# EAGLE design TdsReworkfullSMD (EAGLE 9.2.0)
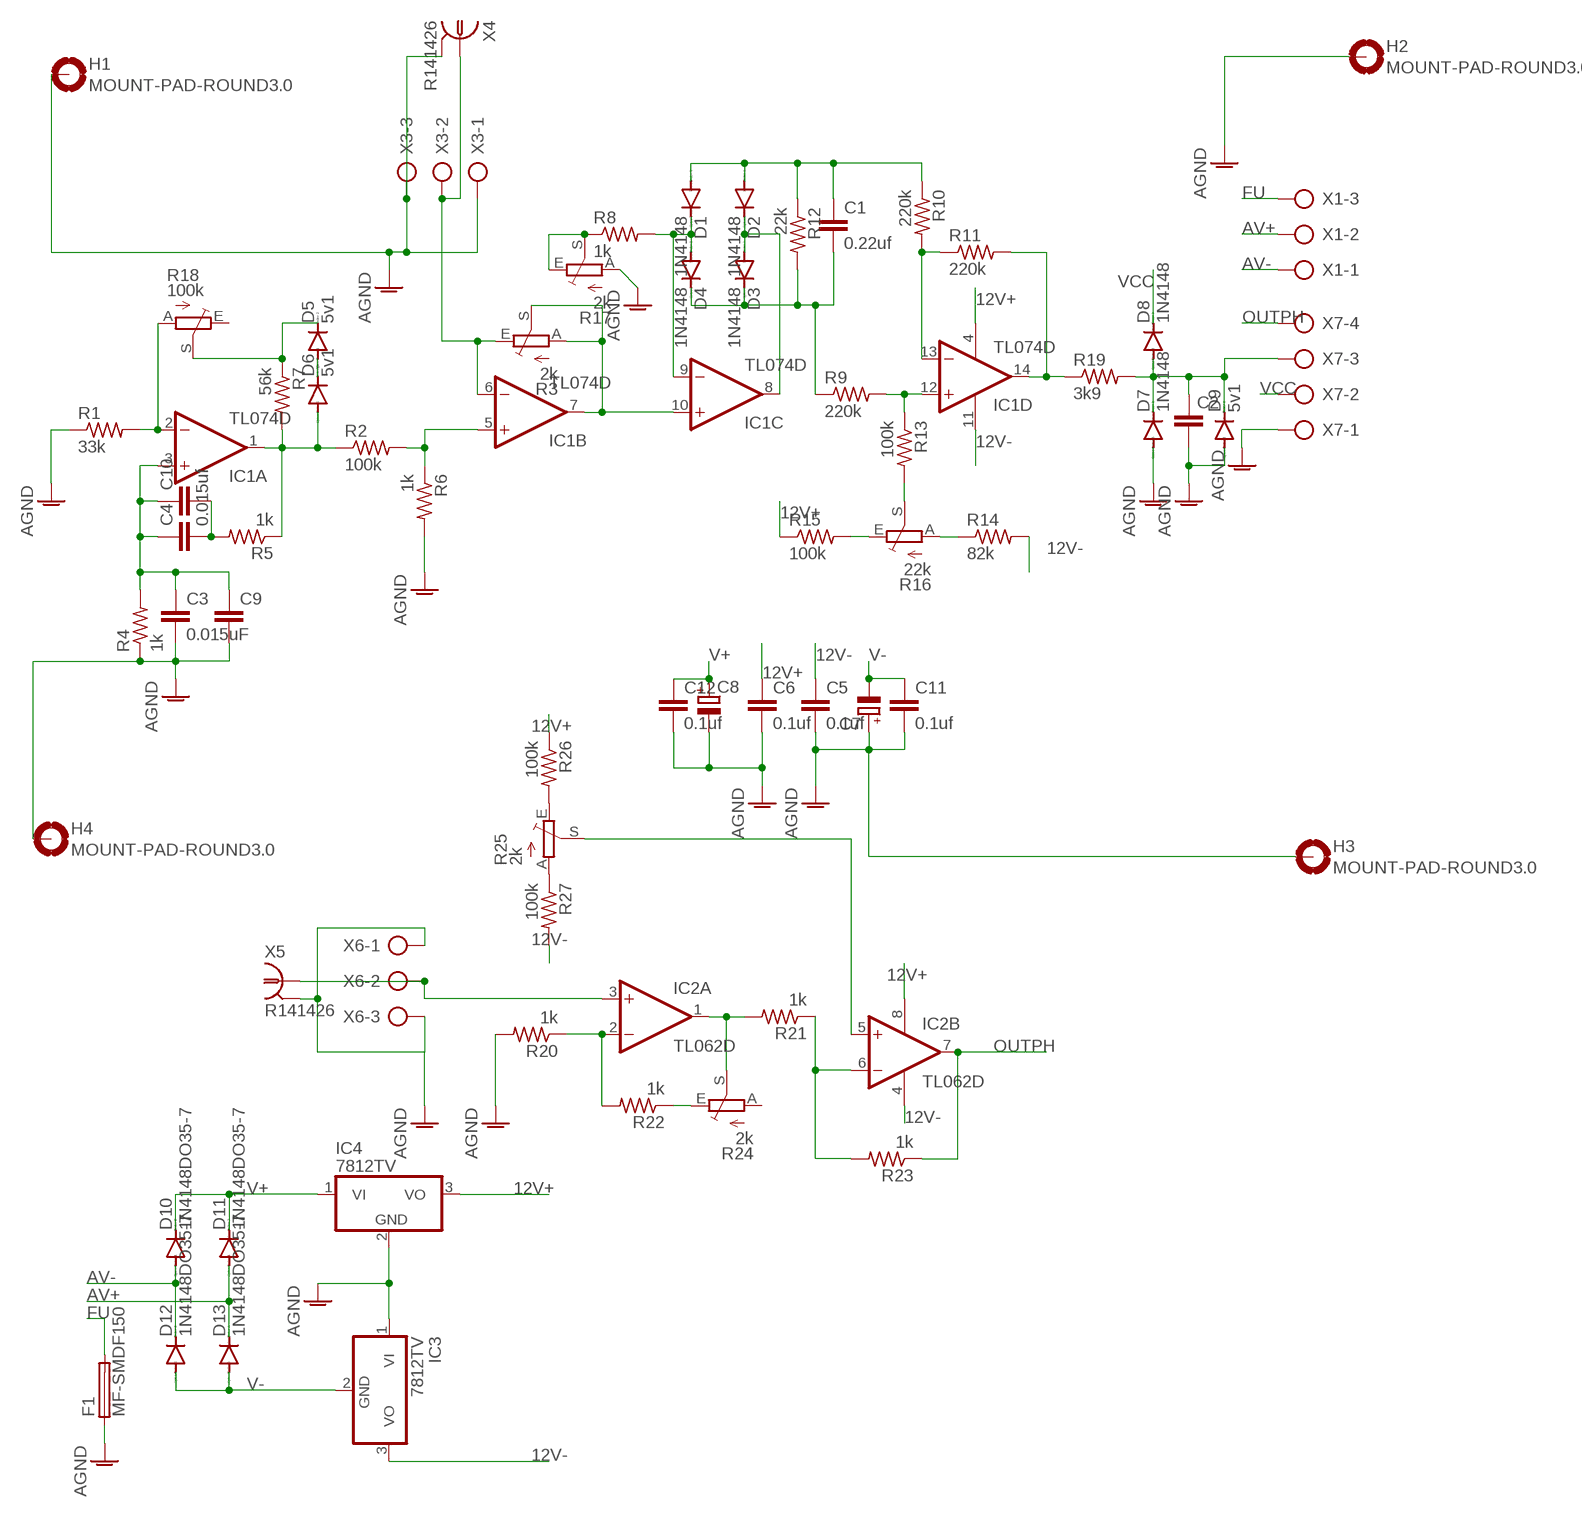
[diagram p0: schematic, sheet 1]

## Parts
C1  0.22uf  C-EUC0805  [C0805]
C2  C-EUC0805  [C0805]
C3  0.015uF  C-EU050-024X044  [C050-024X044]
C4  0.015uf  C-EU050-024X044  [C050-024X044]
C5  0.1uf  C-EUC0805  [C0805]
C6  0.1uf  C-EUC0805  [C0805]
C7  CPOL-EUE5-8.5  [E5-8,5]
C8  CPOL-EUE5-8.5  [E5-8,5]
C9  C-EUC0805  [C0805]
C10  C-EUC0805  [C0805]
C11  0.1uf  C-EUC0805  [C0805]
C12  0.1uf  C-EUC0805  [C0805]
D1  1N4148  1N4148DO35-7  [DO35-7]
D2  1N4148  1N4148DO35-7  [DO35-7]
D3  1N4148  1N4148DO35-7  [DO35-7]
D4  1N4148  1N4148DO35-7  [DO35-7]
D5  5v1  1N4148DO35-7  [DO35-7]
D6  5v1  1N4148DO35-7  [DO35-7]
D7  1N4148  1N4148DO35-7  [DO35-7]
D8  1N4148  1N4148DO35-7  [DO35-7]
D9  5v1  1N4148DO35-7  [DO35-7]
D10  1N4148DO35-7  [DO35-7]
D11  1N4148DO35-7  [DO35-7]
D12  1N4148DO35-7  [DO35-7]
D13  1N4148DO35-7  [DO35-7]
F1  MF-SMDF150  [MF-SMDF050]
H1  MOUNT-PAD-ROUND3.0  [3,0-PAD]
H2  MOUNT-PAD-ROUND3.0  [3,0-PAD]
H3  MOUNT-PAD-ROUND3.0  [3,0-PAD]
H4  MOUNT-PAD-ROUND3.0  [3,0-PAD]
IC1  TL074D  [SO14]
IC2  TL062D  [SO08]
IC3  7812TV  [TO220V]
IC4  7812TV  [TO220V]
R1  33k  R-US_R0805  [R0805]
R2  100k  R-US_R0805  [R0805]
R3  2k  TRIM_EU-S64W  [S64W]
R4  1k  R-US_R0805  [R0805]
R5  1k  R-US_R0805  [R0805]
R6  1k  R-US_R0805  [R0805]
R7  56k  R-US_R0805  [R0805]
R8  1k  R-US_R0805  [R0805]
R9  220k  R-US_R0805  [R0805]
R10  220k  R-US_R0805  [R0805]
R11  220k  R-US_R0805  [R0805]
R12  22k  R-US_R0805  [R0805]
R13  100k  R-US_R0805  [R0805]
R14  82k  R-US_R0805  [R0805]
R15  100k  R-US_R0805  [R0805]
R16  22k  TRIM_EU-S64W  [S64W]
R17  2k  TRIM_EU-S64W  [S64W]
R18  100k  TRIM_EU-S64W  [S64W]
R19  3k9  R-US_R0805  [R0805]
R20  1k  R-US_R0805  [R0805]
R21  1k  R-US_R0805  [R0805]
R22  1k  R-US_R0805  [R0805]
R23  1k  R-US_R0805  [R0805]
R24  2k  TRIM_EU-S64W  [S64W]
R25  2k  TRIM_EU-S64W  [S64W]
R26  100k  R-US_R0805  [R0805]
R27  100k  R-US_R0805  [R0805]
X1  AK500/3  [AK500/3]
X3  AK500/3  [AK500/3]
X4  R141426  [R141426]
X5  R141426  [R141426]
X6  AK500/3  [AK500/3]
X7  AK500/4  [AK500/4]

## Nets
12V+: C6.1 IC1.4(P:V+) IC2.8(P:V+) IC4.3(VO) R15.1 R26.1
12V-: C5.1 IC1.11(P:V-) IC2.4(P:V-) IC3.3(VO) R14.2 R27.2
AGND: C2.2 C3.2 C5.2 C6.2 C7.+ C8.- C9.2 C11.2 C12.2 D7.A D9.A F1.1 H1.B3,0(MOUNT) H2.B3,0(MOUNT) H3.B3,0(MOUNT) H4.B3,0(MOUNT) IC3.1(VI) IC4.2(GND) R1.1 R4.1 R6.2 R17.A R20.2 X3.1 X3.3 X4.2 X4.3 X4.4 X4.5 X5.2 X5.3 X5.4 X5.5 X6.1 X6.3 X7.1
AV+: D11.A D13.C X1.2
AV-: D10.A D12.C X1.1
FU: F1.2 X1.3
N$1: IC1.2(A:-IN) R1.2 R18.A
N$2: IC1.6(B:-IN) R3.E X3.2 X4.1
N$3: IC1.5(B:+IN) R2.2 R6.1
N$4: D6.A IC1.1(A:OUT) R2.1 R5.1 R7.2
N$5: C3.1 C4.1 C9.1 C10.1 IC1.3(A:+IN) R4.2
N$6: IC2.1(A:OUT) R21.2 R24.S
N$7: IC1.7(B:OUT) IC1.10(C:+IN) R3.A R3.S
N$8: C4.2 C10.2 R5.2
N$9: IC1.14(D:OUT) R11.2 R19.1
N$10: C1.1 D1.A D2.A R10.1 R12.1
N$11: D1.C D4.A IC1.9(C:-IN) R8.2
N$12: D2.C D3.A IC1.8(C:OUT)
N$13: IC1.13(D:-IN) R10.2 R11.1
N$14: IC1.12(D:+IN) R9.2 R13.1
N$15: D5.C R7.1 R18.S
N$16: C1.2 D3.C D4.C R9.1 R12.2
N$17: D5.A D6.C
N$18: R13.2 R16.S
N$19: R14.1 R16.A
N$20: R15.2 R16.E
N$21: R8.1 R17.E R17.S
N$22: C2.1 D7.C D8.A D9.C R19.2 X7.3
N$23: IC2.2(A:-IN) R20.1 R22.2
N$24: R22.1 R24.E
N$25: IC2.6(B:-IN) R21.1 R23.2
N$26: IC2.3(A:+IN) X5.1 X6.2
N$27: IC2.5(B:+IN) R25.S
N$29: R25.A R27.1
N$30: R25.E R26.2
OUTPH: IC2.7(B:OUT) R23.1 X7.4
V+: C8.+ C12.1 D10.C D11.C IC4.1(VI)
V-: C7.- C11.1 D12.A D13.A IC3.2(GND)
VCC: D8.C X7.2
Unconnected: R18.E R24.A

## Library data of the parts
C1-C6 C9-C12 = rcl:C-EU: CAPACITOR, European symbol; SPICEPREFIX: C
C7 C8 = rcl:CPOL-EU: POLARIZED CAPACITOR, European symbol; SPICEPREFIX: C
D1-D13 = diode:1N4148: DIODE high speed (Philips)
F1 = fuse:MF-SMDF: MF-SMDF Series - PRC Resettable Fuses Source: http://www.farnell.com/datasheets/716597.pdf
H1-H4 = holes:MOUNT-PAD-ROUND: MOUNTING PAD, round
IC1 = linear:TL074: OP AMP
IC2 = linear:TL062: OP AMP
IC3 IC4 = linear:78*: Positive VOLTAGE REGULATOR Source: http://cache.national.com/ds/LM/LM78L05.pdf http://www.fairchildsemi.com/ds/LM/LM7805.pdf
R1 R2 R4-R15 R19-R23 R26 R27 = resistor:R-US_: RESISTOR, American symbol
R3 R16-R18 R24 R25 = pot:TRIM_EU-: POTENTIOMETER
X1 X3 X6 = con-ptr500:AK500/3: CONNECTOR; OC_FARNELL: unknown; OC_NEWARK: unknown
X4 X5 = con-coax:R141426: BNC COAX CONNECTOR Radiall 50/75 Ohm Spoerle; MF: FARNELL; MPN: R141426161; OC_FARNELL: 4195115; OC_NEWARK: 14J7919
X7 = con-ptr500:AK500/4: CONNECTOR; OC_FARNELL: unknown; OC_NEWARK: unknown

## Board
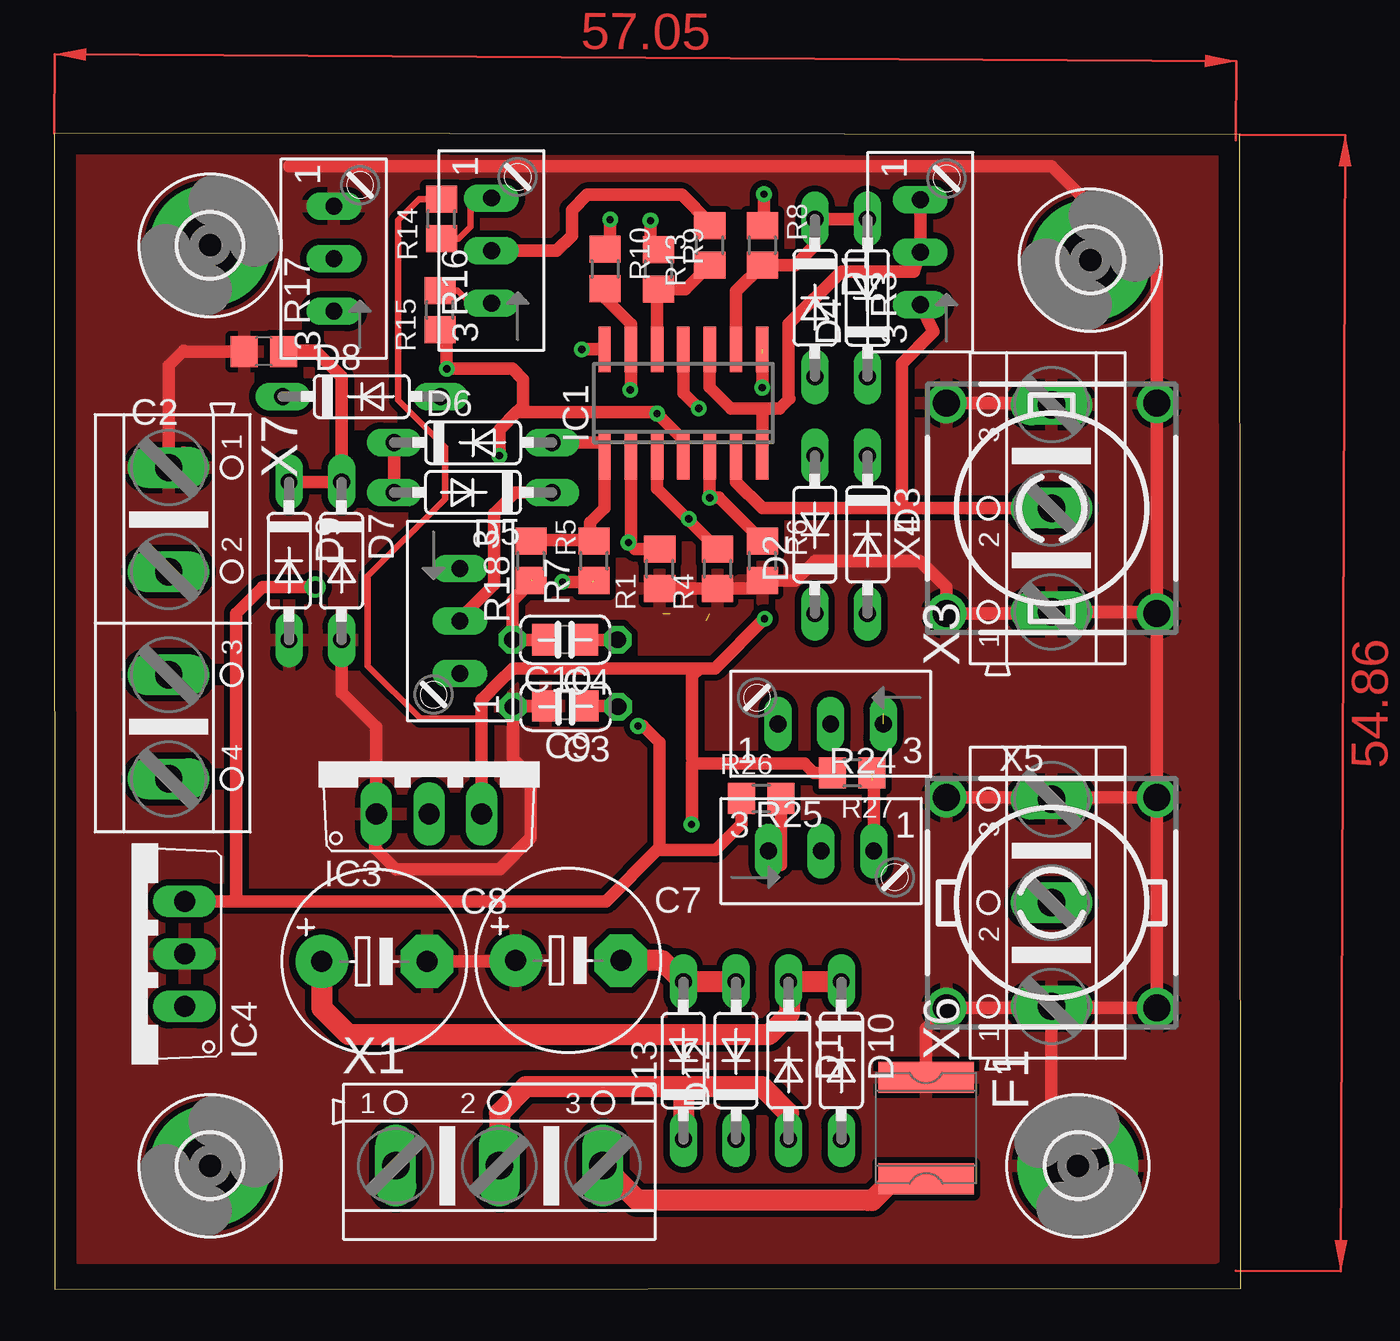
[diagram p1: board, top side]
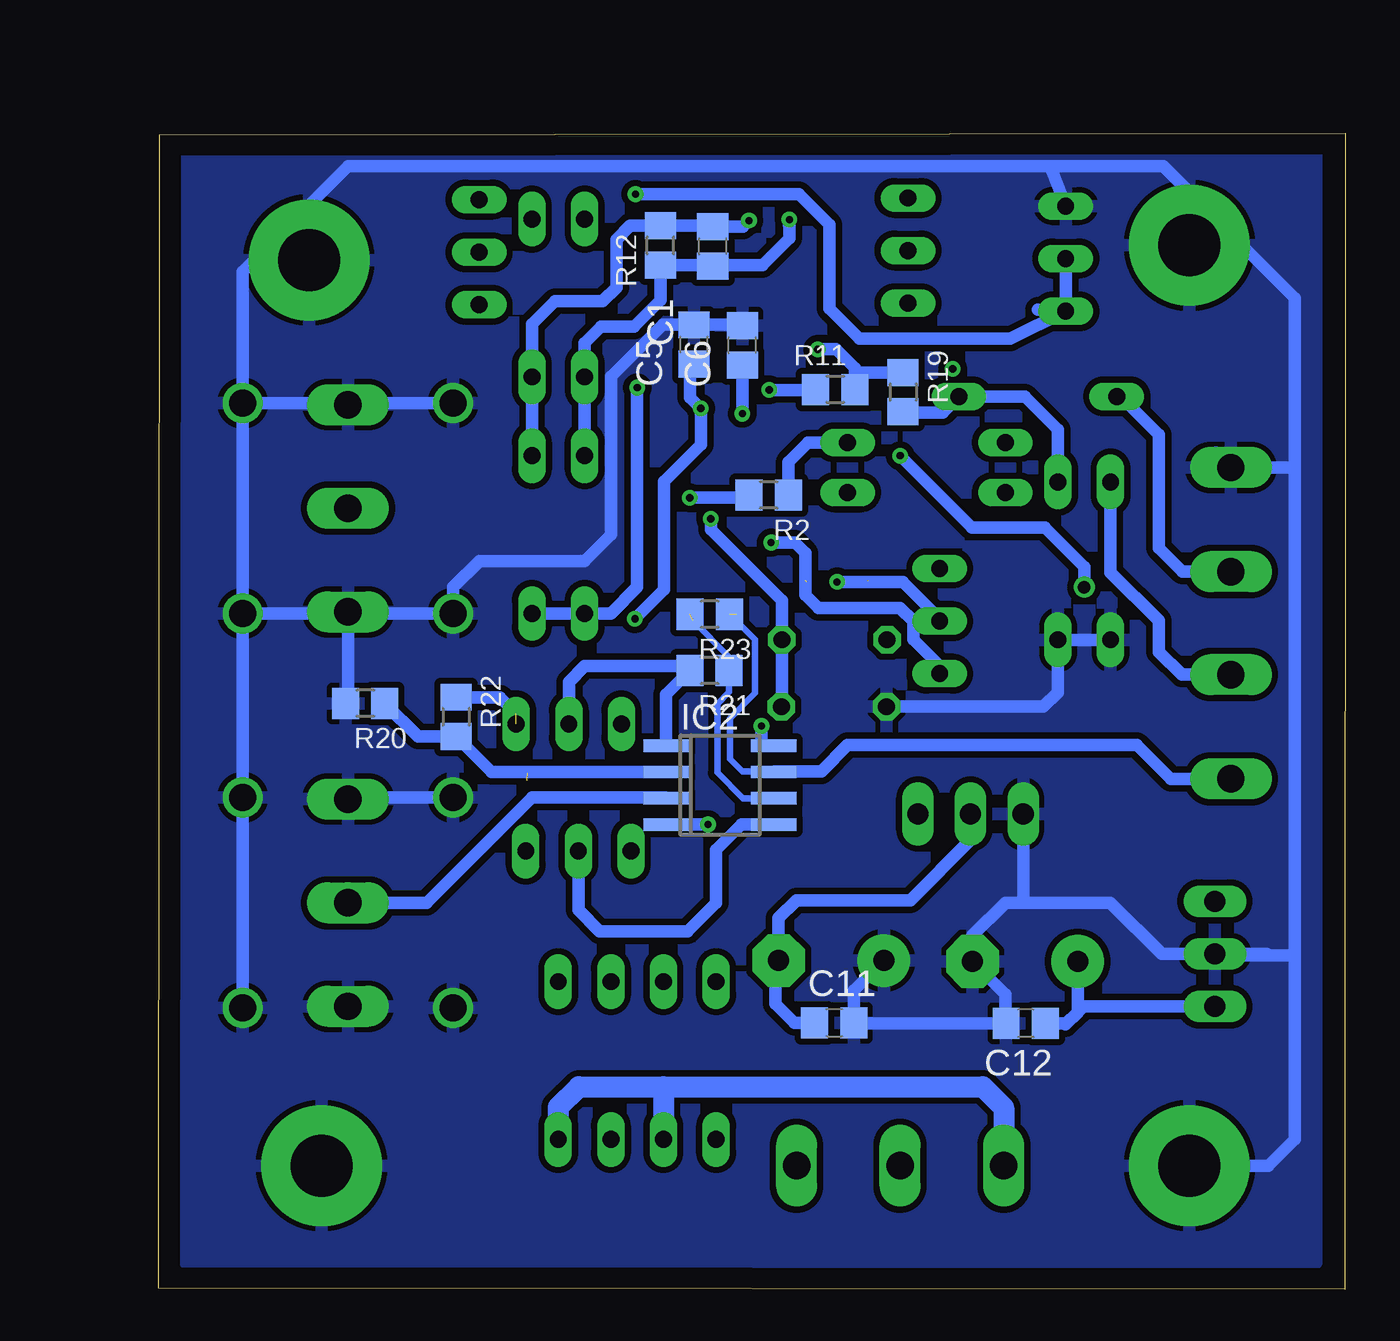
[diagram p2: board, bottom side, seen from below]

Size 57.29 x 55.81 mm. Coordinates in mm from the lower left corner, seen from the top.
Outline: 0.01,0 57.29,0.03 57.25,55.74 0,55.81 0.01,0
Copper layers (1*16): Top 0.035mm / dielectric 1.5mm / Bottom 0.035mm
Design rules "default *": minimum track width 6mil, minimum drill 0.35mm, track to track 0.3mm, track to pad 0.2mm, pad to pad 0.3mm, via to via 0.3mm, smd to smd 0.3mm, copper to edge 40mil, drill to drill 6mil, minimum pad ring 10mil, minimum via ring 8mil, stop-mask expansion 4mil, vias tented up to drill 0mil, thermal gap 10mil

### Footprints (pad centres in the part's own frame; a part is rotated, then mirrored left to right if it is on the bottom)
C0805 = smd 1.3 x 1.5: 1 -0.95,0; 2 0.95,0
C050-024X044 = drill 0.813 octagon: 1 -2.54,0; 2 2.54,0
E5-8,5 = drill 1.016 pad 2.54: + -2.54,0 | drill 1.016 pad 2.54 octagon: - 2.54,0
DO35-7 = drill 0.813 long: A 3.81,0; C -3.81,0
MF-SMDF050 = smd 1.5 x 4.6: 1 -2.45,0; 2 2.45,0
3,0-PAD = drill 3 pad 5.842: B3,0 0,0
SO14 = smd 0.6 x 2.2: 1 -3.81,-2.6; 2 -2.54,-2.6; 3 -1.27,-2.6; 4 0,-2.6; 5 1.27,-2.6; 6 2.54,-2.6; 7 3.81,-2.6; 8 3.81,2.6; 9 2.54,2.6; 10 1.27,2.6; 11 0,2.6; 12 -1.27,2.6; 13 -2.54,2.6; 14 -3.81,2.6
SO08 = smd 0.6 x 2.2: 1 -1.905,-2.6; 2 -0.635,-2.6; 3 0.635,-2.6; 4 1.905,-2.6; 5 1.905,2.6; 6 0.635,2.6; 7 -0.635,2.6; 8 -1.905,2.6
TO220V = drill 1.016 long: 1 -2.54,-2.54; 2 0,-2.54; 3 2.54,-2.54
R0805 = smd 1.3 x 1.5: 1 -0.95,0; 2 0.95,0
S64W = drill 0.813 long: A 2.54,1.27; E -2.54,1.27; S 0,1.27
AK500/3 = drill 1.321 long: 1 -5.004,0; 2 0,0; 3 5.004,0
R141426 = drill 1.295: 1 0,0; 2 5.08,5.08; 3 -5.08,5.08; 4 -5.08,-5.08; 5 5.08,-5.08
AK500/4 = drill 1.321 long: 1 -7.518,0; 2 -2.489,0; 3 2.489,0; 4 7.518,0

### Placement (x,y rotation side)
C1  30.53,50.36 90 bottom
C2  10.11,45.28 180 top
C3  24.68,28.12 180 top
C4  24.66,31.36 180 top
C5  31.44,45.61 90 bottom
C6  29.11,45.57 90 bottom
C7  24.81,15.87 0 top
C8  15.45,15.82 0 top
C9  24.67,28.16 180 top
C10  24.66,31.36 180 top
C11  24.67,12.86 0 bottom
C12  15.42,12.84 180 bottom
D1  36.72,47.87 270 top
D2  36.72,36.44 90 top
D3  39.26,36.44 270 top
D4  39.26,47.87 90 top
D5  20.21,38.47 180 top
D6  20.21,40.88 0 top
D7  13.86,35.17 270 top
D8  14.83,43.11 0 top
D9  11.32,35.17 270 top
D10  37.99,11.04 270 top
D11  35.45,11.04 270 top
D12  32.91,11.04 90 top
D13  30.37,11.04 90 top
F1  42.09,7.78 270 top
H1  50.03,49.69 0 top
H2  49.42,5.96 63.5 top
H3  7.51,5.96 0 top
H4  7.51,50.41 0 top
IC1  30.37,42.79 0 top
IC2  30.19,24.34 270 bottom
IC3  18.09,25.48 0 top
IC4  3.74,16.19 90 top
R1  29.23,34.78 90 top
R2  27.83,38.34 180 bottom
R3  43.08,50.08 90 top
R4  32.03,34.78 90 top
R5  23.01,35.17 270 top
R6  34.18,35.17 270 top
R7  26.06,35.17 90 top
R8  34.18,50.41 270 top
R9  29.16,49.24 270 top
R10  26.59,49.26 270 top
R11  24.63,43.45 0 bottom
R12  33.06,50.4 90 bottom
R13  31.64,50.41 90 top
R14  18.69,51.68 90 top
R15  18.61,47.28 90 top
R16  22.37,50.15 90 top
R17  14.76,49.76 90 top
R18  18.31,32.26 270 top
R19  21.34,43.32 270 bottom
R20  47.32,28.29 180 bottom
R21  30.69,29.87 180 bottom
R22  42.93,27.63 270 bottom
R23  30.68,32.59 180 bottom
R24  37.49,28.56 180 top
R25  37.03,19.88 0 top
R26  34.14,23.7 0 top
R27  38.52,24.92 180 top
X1  21.48,5.96 0 top
X3  48.15,37.71 90 top
X4  48.15,37.71 90 top
X5  48.15,18.66 0 top
X6  48.15,18.66 90 top
X7  5.51,32.16 270 top

### Tracks (layer width: path | path; a pad name or v marks a point on that pad's centre or on a via)
12V+  (via drill 0.35, 0.6)
  Top 0.61: 18.29,46.01 R15.1 18.94,45.99 v18.94,44.44 | v18.94,44.44 v18.94,44.45 | IC1.4 30.37,41.01 v29.1,42.28 29.03,42.36 22.37,42.36 22.35,42.38 | R26.1 33.19,22.47 31.92,21.2 29.1,21.2 | v28.19,27.19 28.43,27.19 29.23,26.4 29.23,21.32 29.1,21.2 | 29.1,21.2 26.64,18.73 IC4.3 8.78,18.73 8.78,32.63 10.05,33.9 v12.59,33.9 | 22.35,42.38 22.63,42.66 22.63,43.93 22.11,44.44 v18.94,44.44 | 22.35,42.38 21.48,41.52 v21.48,40.25
  Bottom 0.305: IC2.8 27.72,26.37 28.19,26.37
  Bottom 0.61: v29.1,42.28 C6.1 28.93,44.44 | v28.19,27.19 28.19,26.37 28.23,26.33 | v21.48,40.25 18.01,36.78 14.49,36.78 12.59,34.88 v12.59,33.9
12V-  (via drill 0.35)
  Top 0.305: 18.69,52.37 R14.2 17.61,52.63 16.59,51.61 16.59,42.94 18.86,40.67 18.86,38.16 15.13,34.43 15.13,30.09 17.67,27.55 20.63,27.55
  Top 0.61: v31.11,42.53 30.37,43.27 IC1.11 | 31.14,29.98 30.78,29.62 30.78,25.64 | v30.76,22.44 30.76,22.53 30.78,22.55 30.78,25.39 36.22,25.39 36.68,24.92 R27.2 | 31.14,29.98 22.14,29.98 21.41,29.24 20.72,28.56 | v34.29,32.38 31.9,29.98 31.14,29.98 | IC3.3 20.63,27.55 20.63,28.46 20.72,28.56
  Bottom 0.61: C5.1 31.64,44.46 31.64,43.06 v31.11,42.53 31.11,40.78 32.89,39 32.89,33.78 v34.29,32.38 | IC2.4 32.78,22.44 v30.76,22.44
AGND
  Top 0.61: R1.1 R4.1 33.8,33.83 R6.2 35.77,34.22 36.72,35.17 41.8,35.17 43.07,33.9 X4.3 | 49.42,32.63 X4.3 | X3.1 53.16,32.7 X4.4 | X4.4 X4.5 53.23,49.14 48.15,54.22 11.32,54.22 | X3.3 48.08,42.79 X4.2 | 43.2,32.5 X4.3 | X5.4 43.12,13.62 43.04,13.7 | 22.75,28.16 22.18,28.16 C3.2 22.14,25.63 22.99,24.78 22.99,21.78 21.49,20.28 16.49,20.28 15.49,21.28 15.49,22.89 IC3.1 | X5.2 X5.3 | 48.15,13.58 X5.5 X4.4 | 48.15,13.58 48.15,5.96 | X6.1 48.15,13.58 | 48.15,13.58 X5.4 | C8.- 22.22,15.82 C7.+ | D7.A 13.86,28.82 15.55,27.13 IC3.1 | 43.07,9.77 42.55,9.77 F1.1 42.09,12.6 X5.4 | IC3.1 15.55,21.72 | 6.24,40.4 X7.1 5.51,44.6 6.24,45.33 6.29,45.28 C2.2 | C9.2 22.75,28.16 | 22.75,28.16 | 50.69,3.42 49.42,4.69 H2.B3,0
  Bottom 0.61: X5.5 X5.2 X4.4 | X5.3 48.08,23.74 X6.3 | 13.86,54.22 48.15,54.22 50.69,51.68 50.69,50.41 51.96,50.41 53.23,49.14 X4.5 | 13.86,54.22 8.78,54.22 6.24,51.68 | C5.2 31.41,46.6 | C5.2 32.95,46.56 35.45,44.06 35.45,36.44 36.72,35.17 41.8,35.17 43.07,33.9 X4.3 X4.4 | C6.2 29.15,46.56 C5.2 | R20.2 48.15,28.4 X3.1 | X4.5 X4.4 | X4.5 X4.2 | 16.4,12.84 23.7,12.84 C11.2 23.72,14.42 C7.+ | 16.4,12.84 C12.2 | 15.77,22.71 IC3.1 15.55,18.71 15.49,18.66 | 22.14,28.16 C3.2 14.56,28.12 13.86,28.82 D7.A D9.A | 16.4,12.84 16.4,14.24 C8.- 17.99,17.07 16.4,18.66 15.49,18.66 | IC4.2 3.78,16.19 | IC4.2 8.86,16.19 11.32,18.66 15.49,18.66 | H3.B3,0 3.7,5.96 2.43,7.23 2.43,16.12 | 6.24,40.4 X7.1 2.54,39.67 2.43,39.78 | 2.43,39.78 2.43,47.87 6.24,51.68 | 2.43,39.78 2.43,16.12 | IC4.2 6.21,16.12 2.43,16.12 | H4.B3,0 6.24,51.68 | R17.A 14.13,53.95 13.86,54.22
  pour Top: 1.16,1.51 1.16,54.72 56.03,54.72 56.03,1.51
  pour Bottom (isolate 0.305): 1.39,1.26 1.39,54.95 55.98,54.95 55.98,1.26
AV+
  Top 0.61: 35.45,8.5 D11.A
  Top 1.016: X1.2 21.48,8.5 22.75,9.77 30.37,9.77 | 30.37,9.77 34.18,9.77 35.45,8.5 | 30.37,9.77 D13.C
AV-
  Bottom 0.61: 17.5,9.77 17.49,9.78 | 37.99,8.5 D10.A
  Bottom 1.016: X1.1 16.48,8.76 17.49,9.78 | 32.91,9.77 17.5,9.77 | 32.91,9.77 37,9.77 37.99,8.78 D10.A | 32.91,9.77 D12.C
FU
  Top 0.61: 26.49,5.28 26.49,4.76 | X1.3 26.49,5.28 | F1.2 40.54,5.33 40.22,5 | 39.26,4.28 27.99,4.28 26.99,5.28 26.49,5.28
  Top 1.016: X1.3 28.17,4.28 39.26,4.28 39.49,4.28 40.22,5
N$1  (via drill 0.35)
  Top 0.61: 29.17,35.67 R1.2 28.04,35.73 v27.72,36.05 27.83,36.17 27.83,37.71 | 27.85,37.69 27.83,37.71 | IC1.2 27.83,37.71
  Bottom 0.61: v27.71,36.05 v27.72,36.05 26.56,36.05 26.06,35.55 26.06,33.51 25.42,32.88 21.48,32.88 20.85,32.25 20.85,31.36 19.21,29.72 R18.A
N$2
  Top 0.61: IC1.6 32.91,38.98 34.18,37.71 40.92,37.71 | X3.2 40.92,37.71 | 40.92,37.71 40.92,44.69 42.45,46.22 R3.E
N$3  (via drill 0.35)
  Top 0.61: IC1.5 v31.64,38.21 32.09,38.21 R6.1
  Bottom 0.61: R2.2 28.91,38.21 v31.64,38.21
N$4
  Top 0.61: R7.2 25.86,36.31 | D6.A 26.56,40.88 IC1.1 26.56,37.71 25.86,37 25.86,36.31 | 25.86,36.31 25.86,36.18 23.07,36.18 R5.1
  Bottom 0.61: R2.1 26.56,38.02 | R2.1 26.56,38.66 | D6.A 25.93,40.88 26.88,39.94 R2.1
N$5  (via drill 0.35)
  Top 0.61: C4.1 C10.1 | IC1.3 29.1,38.66 30.63,37.13 | v30.63,37.2 30.63,37.13 | R4.2 30.63,37.13 | C3.1 27.18,28.16 C9.1
  Bottom 0.61: C3.1 27.2,28.14 C4.1 27.2,33.26 30.63,36.69 v30.63,37.2
N$6
  Bottom 0.61: IC2.1 32.79,28.72 R21.2 31.86,30.09 36.72,30.09 37.49,29.32 R24.S
N$7
  Top 0.61: IC1.10 31.64,43.55 32.66,42.53 34.18,42.53 | 34.18,41.52 IC1.7 34.18,42.53 | R3.A R3.S 41.51,49.14 37.99,49.14 35.45,46.6 35.45,43.04 35.49,43 35.02,42.53 34.18,42.53
N$8  (1 unrouted)
  Top 0.61: 23.07,34.22 22.12,33.26 C4.2 C10.2
N$9  (via drill 0.35)
  Top 0.61: IC1.14 v25.47,45.38
  Bottom 0.61: 21.57,44.5 R19.1 23.59,44.27 23.68,44.18 | v25.47,45.38 24.59,45.38 23.68,44.47 23.68,44.18 | 23.9,43.67 R11.2 23.68,44.18
N$10  (via drill 0.35)
  Top 0.61: v26.84,51.65 26.84,50.68 26.56,50.41 26.56,50.23 R10.1
  Bottom 0.61: D2.A D1.A 36.72,45.68 35.92,46.48 34.34,46.48 33.06,47.76 R12.1 30.49,49.45 | v26.84,51.65 26.85,51.63 26.85,51.37 26.83,51.35 26.83,50.76 28.14,49.45 30.49,49.45 | C1.1 30.49,49.45
N$11
  Top 0.61: IC1.9 32.91,48.19 R8.2 35.77,49.46 36.72,50.41 D1.C D4.A
N$12  (via drill 0.35)  (1 unrouted)
  Top 0.61: 34.18,45.18 v34.18,43.53
  Bottom 0.61: D3.A D2.C 35.45,32.63 34.18,33.9 v34.18,43.53
N$13  (via drill 0.35)
  Top 0.61: R10.2 26.59,47.84 27.83,46.6 IC1.13 27.83,43.42 v27.81,43.42
  Bottom 0.61: R11.1 25.6,43.42 v27.81,43.42
N$14
  Top 0.61: R13.1 30.48,48.29 R9.2 29.1,48.24 IC1.12
N$15  (via drill 0.35)  (1 unrouted)
  Top 0.61: R18.S 19.47,32.26 21.23,34.02 21.23,37.45 22.25,38.47 D5.C | 24.59,34.09 v24.53,34.15 25.99,34.15
  Bottom 0.61: R18.S 19.47,32.26 21.36,34.15 v24.53,34.15
N$16  (via drill 0.35)
  Top 0.61: v28.79,51.6 28.79,50.57 R9.1
  Bottom 0.61: D3.C D4.C 39.26,46.6 38.14,47.72 38.13,47.7 35.86,47.7 35.19,48.37 35.19,50.68 34.52,51.35 R12.2 30.57,51.35 C1.2 29.08,51.31 v28.79,51.6
N$17
  Top 0.61: D6.C D5.A
N$18
  Top 0.61: R16.S 24.26,50.15 24.99,50.88 24.99,52.11 25.72,52.85 30.3,52.85 31.64,51.5 R13.2
N$19
  Top 0.305: R14.1 19.52,50.73 20.09,51.29 20.09,52.31 20.47,52.69 R16.A
N$20
  Top 0.305: R16.E 20.09,47.61 19.47,48.23 R15.2
  Top 0.61: R16.E 21.66,47.61
N$21  (via drill 0.35)
  Top 0.61: R8.1 34.26,51.43 v34.26,52.88
  Bottom 0.61: v34.26,52.88 26.38,52.88 24.9,51.39 24.9,47.34 23.45,45.89 16.16,45.89 R17.E | 14.83,47.29 R17.E | R17.S R17.E
N$22
  Top 0.61: D9.C D7.C 13.86,44.06 12.59,45.33 11.11,45.33 C2.1
  Bottom 0.61: R19.2 21.31,42.33 | 21.31,42.33 21.19,42.22 | D7.C 13.86,41.52 15.45,43.1 D8.A 19.42,42.33 21.31,42.33 | X7.3 7.89,29.67 8.99,30.78 8.99,32.28 11.32,34.61 D9.C
N$23
  Bottom 0.61: R20.1 44.77,26.68 R22.2 41.23,24.97 IC2.2
N$24  (1 unrouted)
  Bottom 0.61: R22.1 40.81,28.58 40.03,27.8
N$25  (1 unrouted)
  Bottom 0.305: IC2.6 29.07,23.7 30.31,24.94 30.31,28.26 29.74,28.83 R21.1 29.74,30.52 31.49,32.28
  Bottom 0.61: 29.77,29.85 R21.1
N$26
  Bottom 0.61: IC2.3 32.82,23.74 39.26,23.74 44.34,18.66 X5.1
N$27
  Bottom 0.61: IC2.5 29.14,22.43 30.37,21.2 30.37,18.66 31.75,17.28 35.99,17.28 37.03,18.31 R25.S
N$29  (1 unrouted)
  Top 0.61: R25.A 39.57,24.51 39.51,24.57
N$30
  Top 0.61: R25.E 35.09,20.48 R26.2
OUTPH  (1 unrouted)
  Bottom 0.305: 29.39,32.59 29.39,32.38 | R23.1 28.49,31.36 28.49,28.78 29.71,27.56 29.71,25.61 29.1,25.01 27.62,25.01 IC2.7
  Bottom 0.61: X7.4 8.42,24.64 10.05,26.28 24.02,26.28 25.29,25.01 27.56,25.01 IC2.7
V+
  Top 0.61: 12.7,15.61 C8.+ 12.99,15.91
  Top 1.016: 35.49,14.85 D11.C | D10.C 35.49,14.85 | C8.+ 12.91,13.58 14.21,12.28 34.49,12.28 35.49,13.28 35.49,14.85
  Bottom 0.61: C8.+ 12.91,13.36 | 12.91,13.36 13.49,12.78 13.56,12.84 C12.1 | IC4.1 12.62,13.65 12.91,13.36
V-
  Top 0.61: 27.35,16.6 C7.-
  Top 1.016: C7.- 29.35,15.87 D13.A D12.A
  Bottom 0.61: C11.1 26.58,12.86 27.49,13.78 27.49,15.73 | 27.49,15.73 C7.- 27.35,17.92 26.49,18.78 20.99,18.78 18.09,21.68 IC3.2 | 27.83,16.12 27.49,15.78 27.49,15.73
VCC
  Bottom 0.61: X7.2 7.86,34.64 8.99,35.78 8.99,41.28 10.82,43.1 D8.C
(copper drawn outside any net)
  shapes: Top area x2